# Altium project avionics_temp_module.PrjPcb
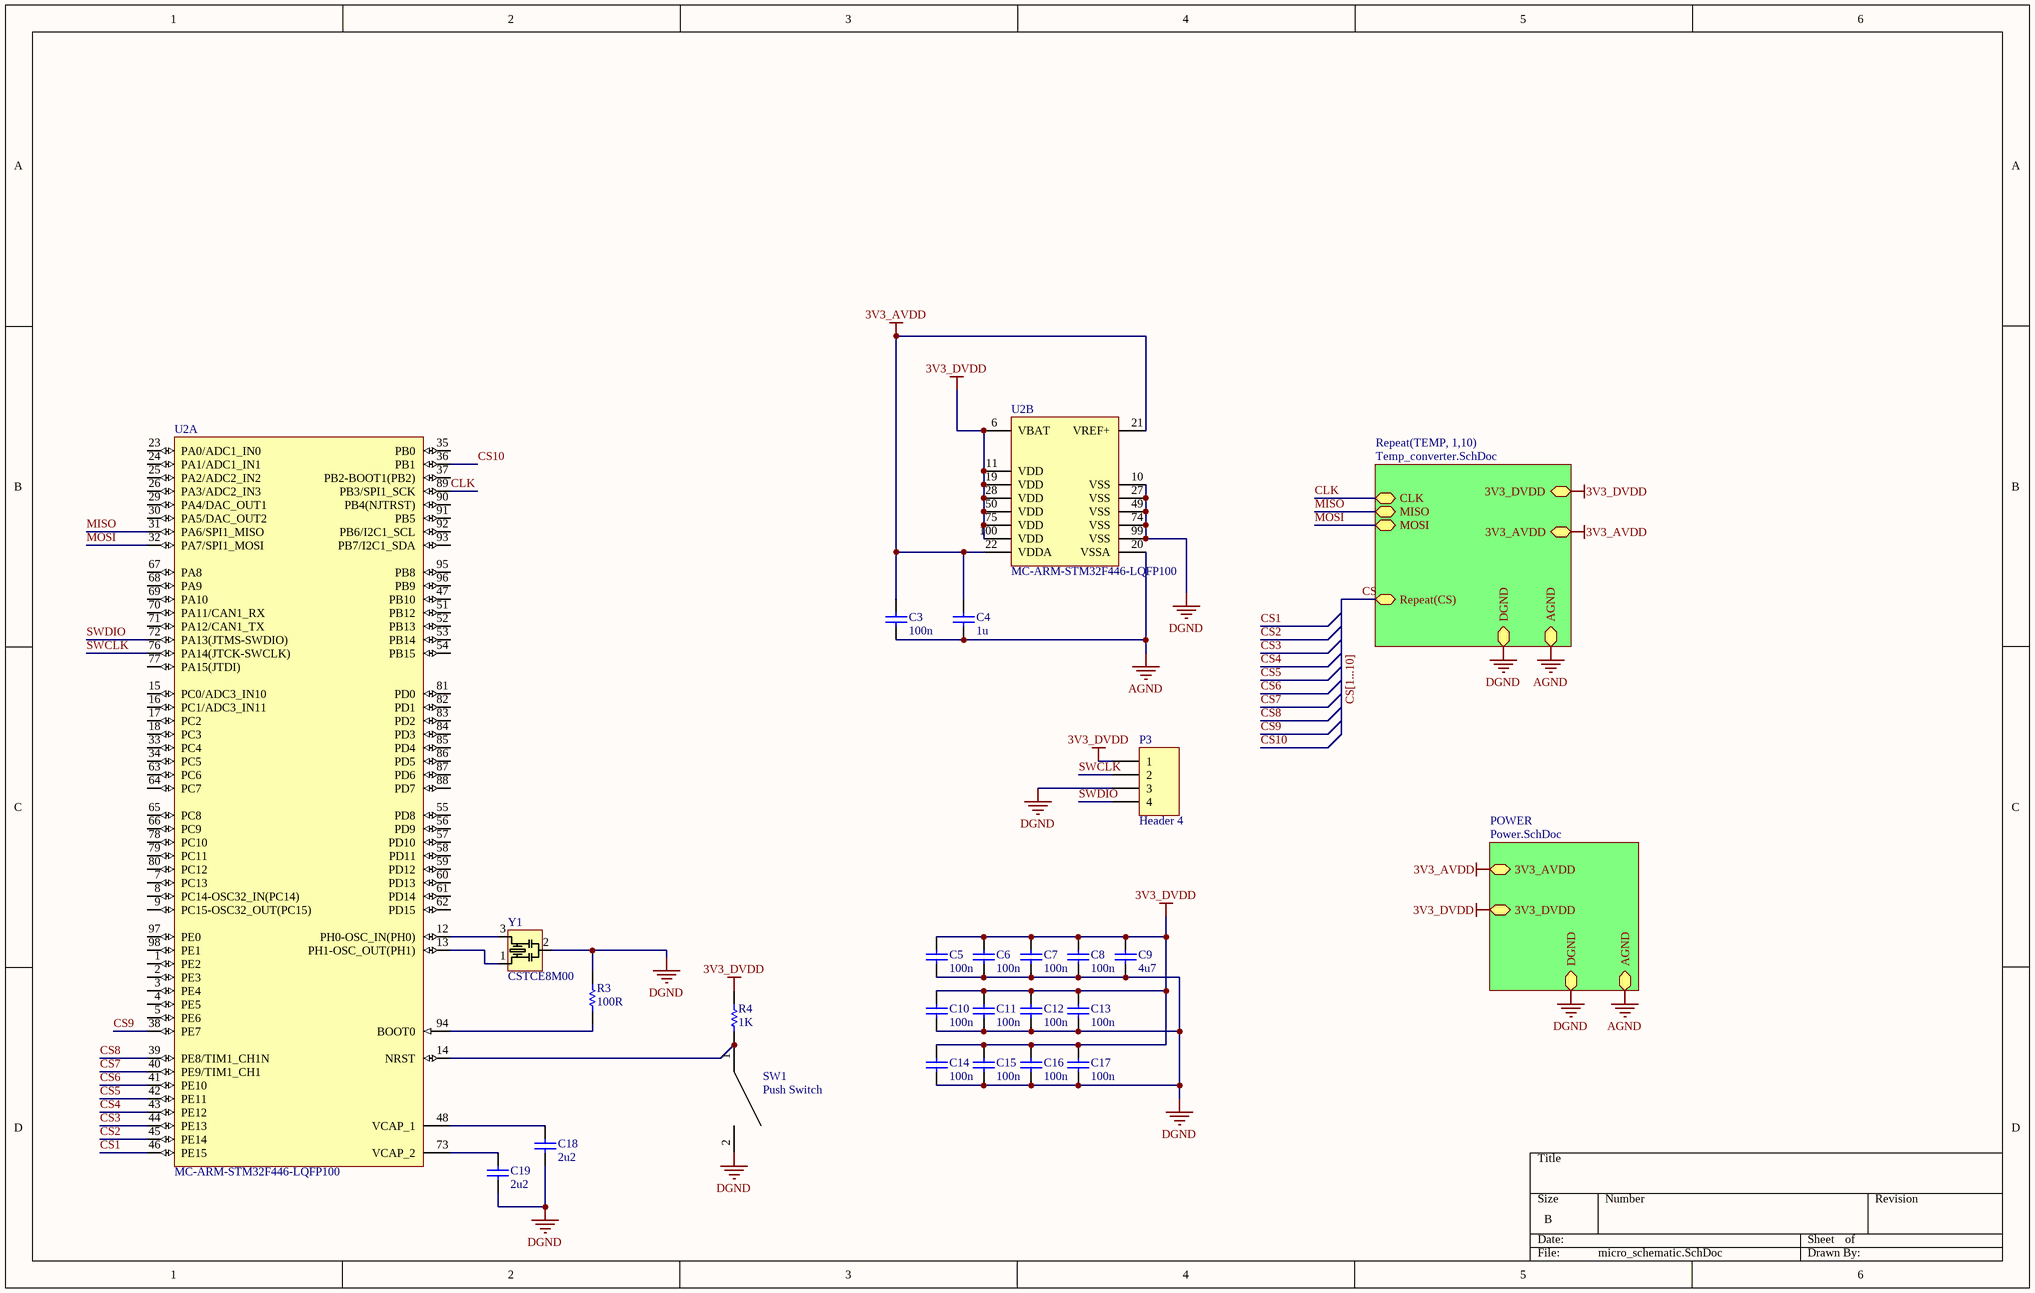
[diagram p0: micro_schematic.SchDoc]
1 sheet, 23 parts. Net scope: hierarchical (ports join the sheet entries above them; power ports are global).
Board file: Temp_module.PcbDoc

## Sheet micro_schematic.SchDoc
size B

### Parts
C3  100n  [C0805]
C4  1u  [C0805]
C5  100n  [C0805]
C6  100n  [C0805]
C7  100n  [C0805]
C8  100n  [C0805]
C9  4u7  [C0805]
C10  100n  [C0805]
C11  100n  [C0805]
C12  100n  [C0805]
C13  100n  [C0805]
C14  100n  [C0805]
C15  100n  [C0805]
C16  100n  [C0805]
C17  100n  [C0805]
C18  2u2  [C0805]
C19  2u2  [C0805]
P3  Header 4  [HDR1X4]
R3  100R  [R0805]
R4  1K  [R0805]
SW1  Push Switch  [PUSHBUTTON]
U2  MC-ARM-STM32F446-LQFP100  [STM-LQFP100_N]  (parts A,B of 2)
Y1  CSTCE8M00  [8MHz Ceramic Resonator]

### Sub-sheets
POWER = Power.SchDoc (file not in this document): 3V3_DVDD, 3V3_AVDD, DGND, AGND
Repeat(TEMP, 1,10) = Temp_converter.SchDoc (file not in this document): AGND, MOSI, DGND, Repeat(CS), 3V3_DVDD, MISO, 3V3_AVDD, CLK

### Nets
3V3_AVDD: C3.1 C4.1 U2.21(VREF+) U2.22(VDDA) ; sheet Repeat(TEMP, 1,10)/3V3_AVDD, sheet POWER/3V3_AVDD
3V3_DVDD: C5.1 C6.1 C7.1 C8.1 C9.1 C10.1 C11.1 C12.1 C13.1 C14.1 C15.1 C16.1 C17.1 P3.1 R4.2 U2.6(VBAT) U2.11(VDD) U2.19(VDD) U2.28(VDD) U2.50(VDD) U2.75(VDD) U2.100(VDD) ; sheet Repeat(TEMP, 1,10)/3V3_DVDD, sheet POWER/3V3_DVDD
AGND: C3.2 C4.2 U2.20(VSSA) ; sheet Repeat(TEMP, 1,10)/AGND, sheet POWER/AGND
DGND: C5.2 C6.2 C7.2 C8.2 C9.2 C10.2 C11.2 C12.2 C13.2 C14.2 C15.2 C16.2 C17.2 C18.2 C19.2 P3.3 R3.2 SW1.2 U2.10(VSS) U2.27(VSS) U2.49(VSS) U2.74(VSS) U2.99(VSS) Y1.2(GND) ; sheet Repeat(TEMP, 1,10)/DGND, sheet POWER/DGND
CLK: U2.89(PB3/SPI1_SCK) ; sheet Repeat(TEMP, 1,10)/CLK
CS: sheet Repeat(TEMP, 1,10)/Repeat(CS)
CS1: U2.46(PE15)
CS2: U2.45(PE14)
CS3: U2.44(PE13)
CS4: U2.43(PE12)
CS5: U2.42(PE11)
CS6: U2.41(PE10)
CS7: U2.40(PE9/TIM1_CH1)
CS8: U2.39(PE8/TIM1_CH1N)
CS9: U2.38(PE7)
CS10: U2.36(PB1)
MISO: U2.31(PA6/SPI1_MISO) ; sheet Repeat(TEMP, 1,10)/MISO
MOSI: U2.32(PA7/SPI1_MOSI) ; sheet Repeat(TEMP, 1,10)/MOSI
SWCLK: P3.2 U2.76(PA14(JTCK-SWCLK))
SWDIO: P3.4 U2.72(PA13(JTMS-SWDIO))
NetC18_1: C18.1 U2.48(VCAP_1)
NetC19_1: C19.1 U2.73(VCAP_2)
NetR3_1: R3.1 U2.94(BOOT0)
NetR4_1: R4.1 SW1.1 U2.14(NRST)
NetU2_12: U2.12(PH0-OSC_IN(PH0)) Y1.3(OSC2)
NetU2_13: U2.13(PH1-OSC_OUT(PH1)) Y1.1(OSC1)

Not connected (* = marked no-connect by the designer): U2 1(PE2) 2(PE3) 3(PE4) 4(PE5) 5(PE6) 7(PC13) 8(PC14-OSC32_IN(PC14)) 9(PC15-OSC32_OUT(PC15)) 15(PC0/ADC3_IN10) 16(PC1/ADC3_IN11) 17(PC2) 18(PC3) 23(PA0/ADC1_IN0) 24(PA1/ADC1_IN1) 25(PA2/ADC2_IN2) 26(PA3/ADC2_IN3) 29(PA4/DAC_OUT1) 30(PA5/DAC_OUT2) 33(PC4) 34(PC5) 35(PB0) 37(PB2-BOOT1(PB2)) 47(PB10) 51(PB12) 52(PB13) 53(PB14) 54(PB15) 55(PD8) 56(PD9) 57(PD10) 58(PD11) 59(PD12) 60(PD13) 61(PD14) 62(PD15) 63(PC6) 64(PC7) 65(PC8) 66(PC9) 67(PA8) 68(PA9) 69(PA10) 70(PA11/CAN1_RX) 71(PA12/CAN1_TX) 77(PA15(JTDI)) 78(PC10) 79(PC11) 80(PC12) 81(PD0) 82(PD1) 83(PD2) 84(PD3) 85(PD4) 86(PD5) 87(PD6) 88(PD7) 90(PB4(NJTRST)) 91(PB5) 92(PB6/I2C1_SCL) 93(PB7/I2C1_SDA) 95(PB8) 96(PB9) 97(PE0) 98(PE1)

### Buses and harness runs
bus CS[1...10]

### Library data of the parts
C3-C19 = C0805: 0805 Capacitor
  C3 C5-C8 C10-C17: Value: 100n
  C4: Value: 1u
  C9: Value: 4u7
  C18 C19: Value: 2u2
P3 = Header 4: Header, 4-Pin; LatestRevisionDate: 17-Jul-2002; LatestRevisionNote: Re-released for DXP Platform.; Publisher: Altium Limited
R3 R4 = R0805: RESISTOR 0805
  R3: Value: 100R
  R4: Value: 1K
SW1 = PUSHBUTTON
Y1 = CSTCE8M00: 8MHz Ceramic Resonator